# Altium project IRLED.PrjPcb
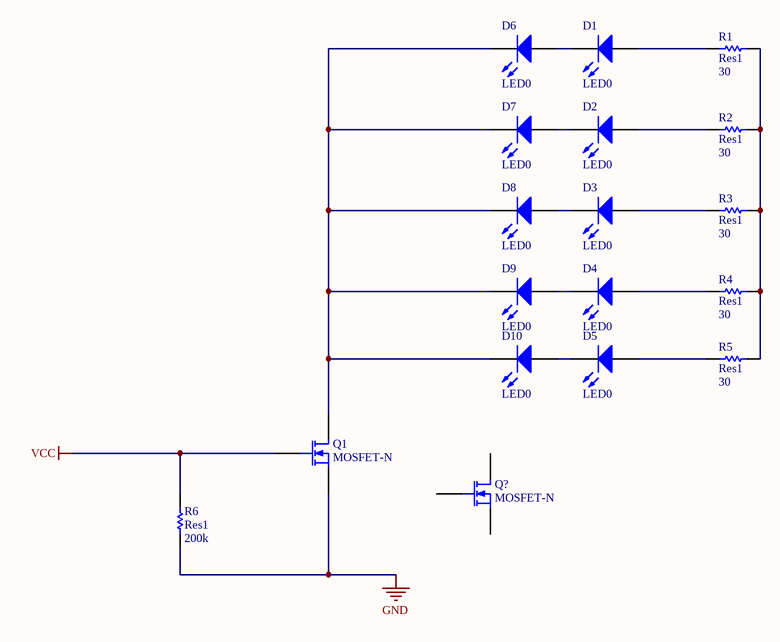
[diagram p0: IRLED.SchDoc]
1 sheet, 18 parts. Net scope: global (net labels, ports and power ports of the same name join across sheets).
Board file: IRLED.PcbDoc

## Sheet IRLED.SchDoc
size A

### Parts
D1  LED0  [LED-0]
D2  LED0  [LED-0]
D3  LED0  [LED-0]
D4  LED0  [LED-0]
D5  LED0  [LED-0]
D6  LED0  [LED-0]
D7  LED0  [LED-0]
D8  LED0  [LED-0]
D9  LED0  [LED-0]
D10  LED0  [LED-0]
Q1  MOSFET-N  [E3]
Q?  MOSFET-N  [E3]
R1  Res1  value 30  [AXIAL-0.3]
R2  Res1  value 30  [AXIAL-0.3]
R3  Res1  value 30  [AXIAL-0.3]
R4  Res1  value 30  [AXIAL-0.3]
R5  Res1  value 30  [AXIAL-0.3]
R6  Res1  value 200k  [AXIAL-0.3]

### Nets
GND: Q1.3(S) R6.1
VCC: Q1.2(G) R6.2
NetD1_1: D1.1(A) R1.1
NetD1_2: D1.2(K) D6.1(A)
NetD2_1: D2.1(A) R2.1
NetD2_2: D2.2(K) D7.1(A)
NetD3_1: D3.1(A) R3.1
NetD3_2: D3.2(K) D8.1(A)
NetD4_1: D4.1(A) R4.1
NetD4_2: D4.2(K) D9.1(A)
NetD5_1: D5.1(A) R5.1
NetD5_2: D5.2(K) D10.1(A)
NetD6_2: D6.2(K) D7.2(K) D8.2(K) D9.2(K) D10.2(K) Q1.1(D)
NetR1_2: R1.2 R2.2 R3.2 R4.2 R5.2

Not connected (* = marked no-connect by the designer): Q? 1(D) 2(G) 3(S)

### Library data of the parts
D1-D10 = LED0: Typical INFRARED GaAs LED; Published: 8-Jun-2000; LatestRevisionDate: 08-Jul-2005; LatestRevisionNote: Mech Layer 1 removed.; PackageReference: LED-0; Publisher: Altium Limited; PackageDescription: LED; 2 Leads
Q1 Q? = MOSFET-N: N-Channel MOSFET; Published: 8-Jun-2000; LatestRevisionDate: 17-Jul-2002; LatestRevisionNote: Re-released for DXP Platform.; PackageVersion: 1995/1996; PackageReference: E3; Publisher: Altium Limited; PackageDescription: TO, Flat Index; 3 In-Line, Axial Leads; Body Dia. 4.6mm; Lead Dia. 0.5 mm (max)
R1-R6 = Res1: Resistor; Published: 8-Jun-2000; LatestRevisionDate: 17-Jul-2002; LatestRevisionNote: Re-released for DXP Platform.; PackageReference: AXIAL-0.3; Publisher: Altium Limited; PackageDescription: Axial Device, Thru-Hole; 2 Leads; 0.3 in Pin Spacing